# EAGLE design schematic.luminosidade.controle (EAGLE 6.5.0)
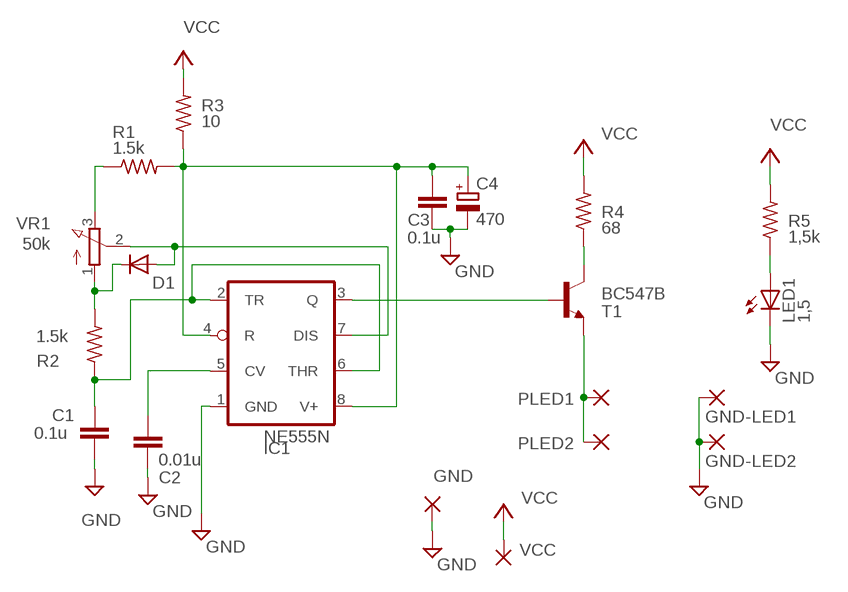
[diagram p0: schematic, sheet 1]

## Parts
C1  0.1u  C-EU025-024X044  [C025-024X044]
C2  0.01u  C-EU025-024X044  [C025-024X044]
C3  0.1u  C-EU025-024X044  [C025-024X044]
C4  470  CPOL-EUE3.5-10  [E3,5-10]
D1  1N4148DO35-7  [DO35-7]
GND  ET1  2,15/1,0  [2,15/1,0]
GND-LED1  GPAD  2,15/1,0  [2,15/1,0]
GND-LED2  GPAD  2,15/1,0  [2,15/1,0]
IC1  NE555N  [DIL08]
LED1  1,5  LED5MM  [LED5MM]
PLED1  ET1  2,15/1,0  [2,15/1,0]
PLED2  ET1  2,15/1,0  [2,15/1,0]
R1  1.5k  R-US_0204/5  [0204/5]
R2  1.5k  R-US_0204/5  [0204/5]
R3  10  R-US_0204/5  [0204/5]
R4  68  R-US_0204/5  [0204/5]
R5  1,5k  R-US_0204/5  [0204/5]
T1  BC547B  [TO92]
VCC  ET1  2,15/1,0  [2,15/1,0]
VR1  50k  3RP/1610N  [3RP/1610N]

## Nets
GND: C1.2 C2.2 C3.2 C4.- GND-LED1.1(P) GND-LED2.1(P) GND.1(P) IC1.1(GND) LED1.K(C)
N$1: C1.1 IC1.2(TR) IC1.6(THR) R2.1
N$2: D1.C R2.2 VR1.1(A)
N$3: D1.A IC1.7(DIS) VR1.2(S)
N$4: C2.1 IC1.5(CV)
N$5: R1.1 VR1.3(E)
N$6: IC1.3(Q) T1.2(B)
N$7: C3.1 C4.+ IC1.4(R) IC1.8(V+) R1.2 R3.1
N$8: R4.1 T1.3(C)
N$9: LED1.A R5.1
N$10: PLED1.1(P) PLED2.1(P) T1.1(E)
VCC: R3.2 R4.2 R5.2 VCC.1(P)

## Library data of the parts
C1-C3 = rcl:C-EU: CAPACITOR, European symbol
C4 = rcl:CPOL-EU: POLARIZED CAPACITOR, European symbol
D1 = diode:1N4148: DIODE high speed (Philips)
GND GND-LED1 GND-LED2 PLED1 PLED2 VCC = wirepad:2,15/1,0: THROUGH-HOLE PAD
IC1 = linear:*555: TIMER
LED1 = led:LED: LED OSRAM: - CHIPLED LG R971, LG N971, LY N971, LG Q971, LY Q971, LO R971, LY R971 LH N974, LH R974 LS Q976, LO Q976, LY Q976 LO Q996 - Hyper CHIPLED LW Q18S LB Q993, LB Q99A, LB R99A - SideLED LS A670, LO A670, LY A670, LG A670, LP A670 LB A673, LV A673, LT A673, LW A673 LH A674 LY A675 LS A676, LA A676, LO A676, LY A676, LW A676 LS A679, LY A679, LG A679 - Hyper Micro SIDELED® LS Y876, LA Y876, LO Y876, LY Y876 LT Y87S - SmartLED LW L88C, LW L88S LB L89C, LB L89S, LG L890 LS L89K, LO L89K, LY L89K LS L896, LA L896, LO L896, LY L896 - TOPLED LS T670, LO T670, LY T670, LG T670, LP T670 LSG T670, LSP T670, LSY T670, LOP T670, LYG T670 LG T671, LOG T671, LSG T671 LB T673, LV T673, LT T673, LW T673 LH T674 LS T676, LA T676, LO T676, LY T676, LB T676, LH T676, LSB T676, LW T676 LB T67C, LV T67C, LT T67C, LS T67K, LO T67K, LY T67K, LW E67C LS E67B, LA E67B, LO E67B, LY E67B, LB E67C, LV E67C, LT E67C LW T67C LS T679, LY T679, LG T679 LS T770, LO T770, LY T770, LG T770, LP T770 LB T773, LV T773, LT T773, LW T773 LH T774 LS E675, LA E675, LY E675, LS T675 LS T776, LA T776, LO T776, LY T776, LB T776 LHGB T686 LT T68C, LB T68C - Hyper Mini TOPLED® LB M676 - Mini TOPLED Santana® LG M470 LS M47K, LO M47K, LY M47K Source: http://www.osram.convergy.de LUXEON: - LUMILED® LXK2-PW12-R00, LXK2-PW12-S00, LXK2-PW14-U00, LXK2-PW14-V00 LXK2-PM12-R00, LXK2-PM12-S00, LXK2-PM14-U00 LXK2-PE12-Q00, LXK2-PE12-R00, LXK2-PE12-S00, LXK2-PE14-T00, LXK2-PE14-U00 LXK2-PB12-K00, LXK2-PB12-L00, LXK2-PB12-M00, LXK2-PB14-N00, LXK2-PB14-P00, LXK2-PB14-Q00 LXK2-PR12-L00, LXK2-PR12-M00, LXK2-PR14-Q00, LXK2-PR14-R00 LXK2-PD12-Q00, LXK2-PD12-R00, LXK2-PD12-S00 LXK2-PH12-R00, LXK2-PH12-S00 LXK2-PL12-P00, LXK2-PL12-Q00, LXK2-PL12-R00 Source: www.luxeon.com KINGBRIGHT: KA-3528ASYC Source: www.kingbright.com
R1-R5 = rcl:R-US_: RESISTOR, American symbol
T1 = transistor-npn:BC547*: NPN Transistor
VR1 = pot:3RP/1610N: 16mm Potentiometer one level Source: http://www.alphapotentiometers.net/html/16mm_pot_2.html

## Board
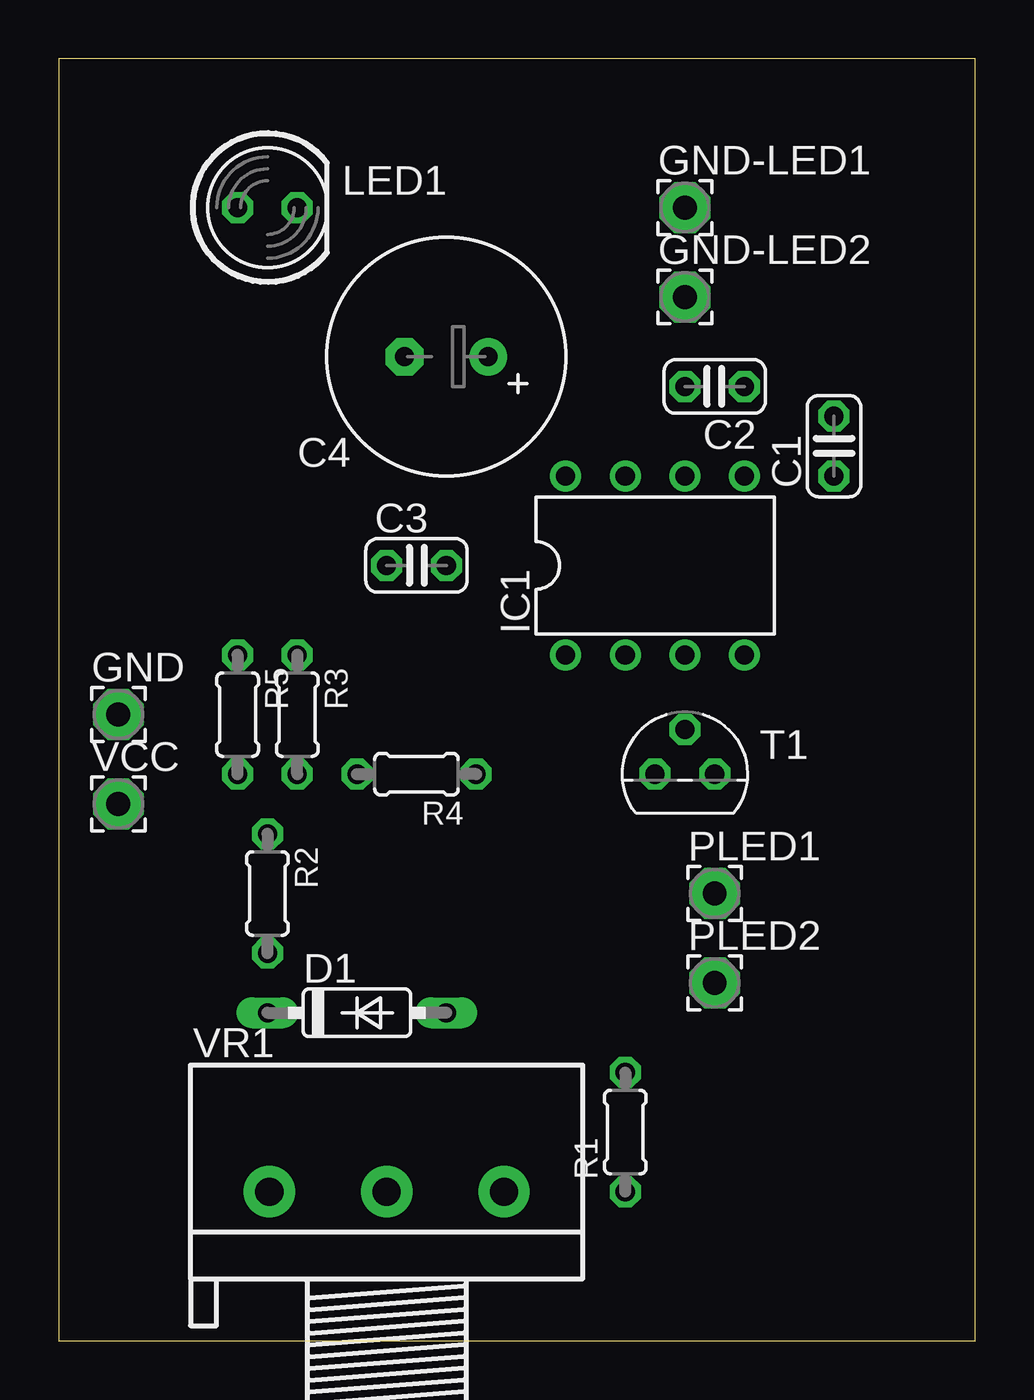
[diagram p1: board, top side]
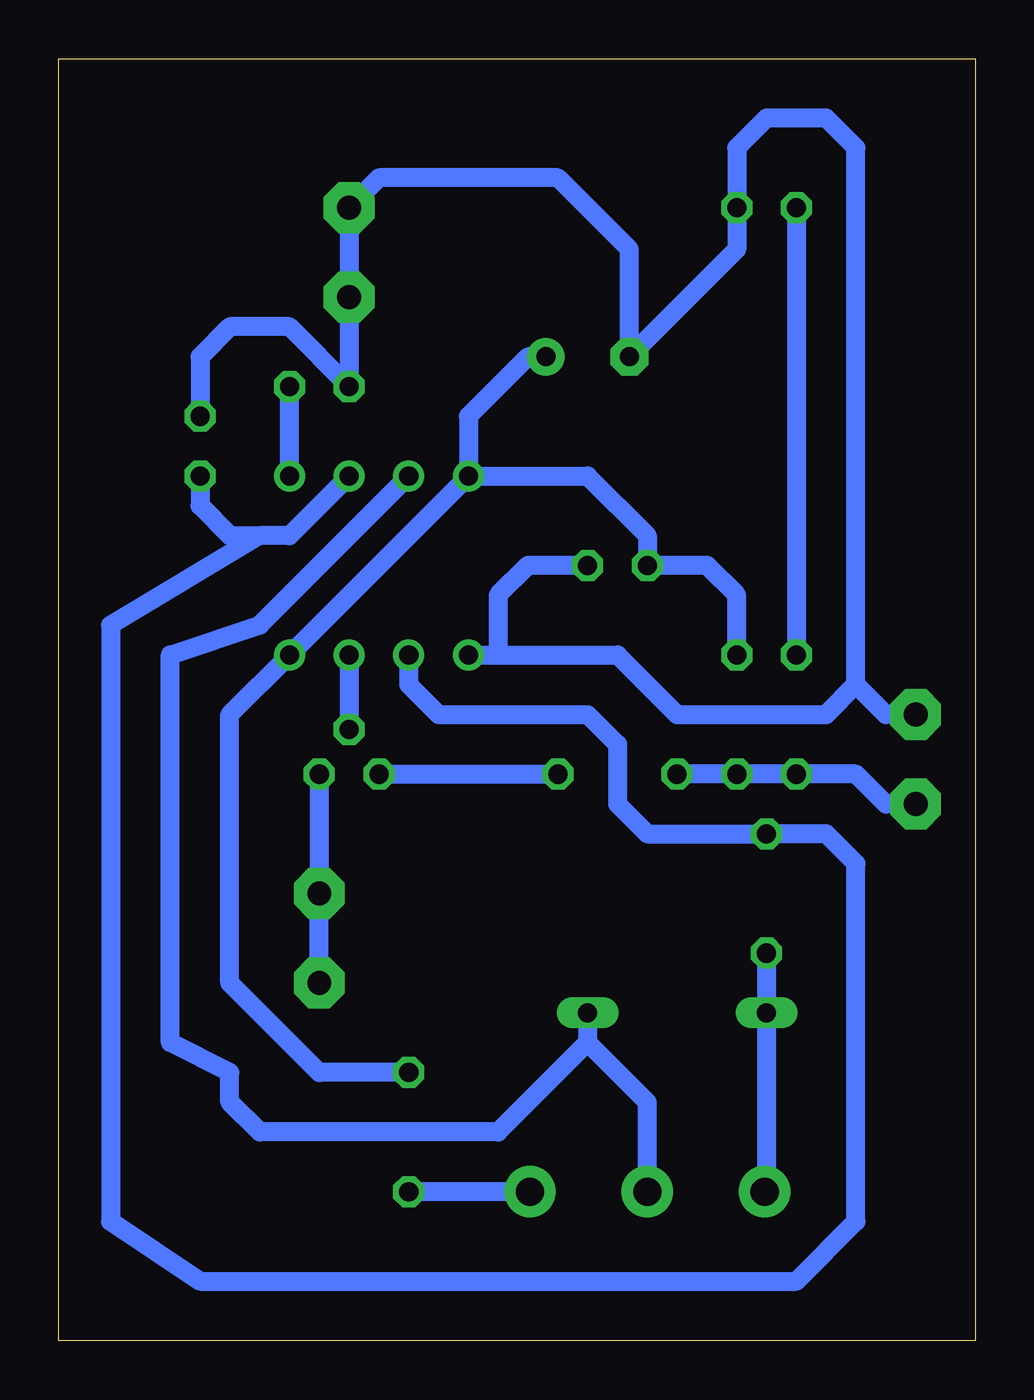
[diagram p2: board, bottom side, seen from below]

Size 39.04 x 54.6 mm. Coordinates in mm from the lower left corner, seen from the top.
Outline: 0,0 39.04,0 39.04,54.6 0,54.6 0,0
Copper layers (1*16): Top 0.035mm / dielectric 1.5mm / Bottom 0.035mm
Design rules "default": minimum track width 10mil, minimum drill 24mil, track to track 8mil, track to pad 8mil, pad to pad 8mil, via to via 8mil, smd to smd 8mil, copper to edge 40mil, drill to drill 8mil, minimum pad ring 10mil, minimum via ring 8mil, stop-mask expansion 4mil, vias tented up to drill 0mil, thermal gap 10mil

### Footprints (pad centres in the part's own frame; a part is rotated, then mirrored left to right if it is on the bottom)
C025-024X044 = drill 0.813 octagon: 1 -1.27,0; 2 1.27,0
E3,5-10 = drill 0.813 pad 1.6: + -1.778,0 | drill 0.813 pad 1.6 octagon: - 1.778,0
DO35-7 = drill 0.813 long: A 3.81,0; C -3.81,0
2,15/1,0 = drill 1.016 pad 2.159 octagon: 1 0,0
DIL08 = drill 0.813 pad 1.27: 1 -3.81,-3.81; 2 -1.27,-3.81; 3 1.27,-3.81; 4 3.81,-3.81; 5 3.81,3.81; 6 1.27,3.81; 7 -1.27,3.81; 8 -3.81,3.81
LED5MM = drill 0.813 octagon: A -1.27,0; K 1.27,0
0204/5 = drill 0.813 octagon: 1 -2.54,0; 2 2.54,0
TO92 = drill 0.813 octagon: 1 1.27,0; 2 0,1.905; 3 -1.27,0
3RP/1610N = drill 1.2 pad 2.184: 1 -5,0; 2 0,0; 3 5,0

### Placement (x,y rotation side)
C1  33.02,38.1 90 top
C2  27.94,40.64 180 top
C3  15.24,33.02 0 top
C4  16.51,41.91 180 top
D1  12.7,13.97 0 top
GND  2.54,26.67 0 top
GND-LED1  26.67,48.26 0 top
GND-LED2  26.67,44.45 0 top
IC1  25.4,33.02 0 top
LED1  8.89,48.26 0 top
PLED1  27.94,19.05 0 top
PLED2  27.94,15.24 0 top
R1  24.13,8.89 90 top
R2  8.89,19.05 270 top
R3  10.16,26.67 270 top
R4  15.24,24.13 180 top
R5  7.62,26.67 270 top
T1  26.67,24.13 0 top
VCC  2.54,22.86 0 top
VR1  13.97,6.35 0 top

### Tracks (layer width: path | path; a pad name or v marks a point on that pad's centre or on a via)
GND
  Bottom 0.813: C1.2 33.02,41.91 31.75,43.18 29.21,43.18 C2.2 GND-LED2.1 GND-LED1.1 25.4,49.53 17.78,49.53 14.73,46.48 C4.- 10.16,46.48 LED1.K 10.16,50.8 8.89,52.07 6.35,52.07 5.08,50.8 5.08,27.94 | IC1.1 20.32,29.21 | 5.08,27.94 6.35,26.67 12.7,26.67 15.24,29.21 20.32,29.21 | C3.2 19.05,33.02 20.32,31.75 20.32,29.21 | GND.1 3.81,26.67 5.08,27.94
N$1
  Bottom 0.813: C1.1 33.02,35.56 31.75,34.29 30.48,34.29 | IC1.6 29.21,34.29 30.48,34.29 | 30.48,34.29 36.83,30.48 36.83,5.08 33.02,2.54 7.62,2.54 5.08,5.08 5.08,20.32 6.35,21.59 R2.1 13.97,21.59 15.24,22.86 15.24,25.4 16.51,26.67 22.86,26.67 24.13,27.94 IC1.2
N$2
  Bottom 0.813: VR1.1 8.89,6.43 D1.C R2.2
N$3
  Bottom 0.813: VR1.2 13.97,10.16 16.51,12.7 | D1.A 16.51,12.7 | 16.51,12.7 20.32,8.89 30.48,8.89 31.75,10.16 31.75,11.43 34.29,12.7 34.29,29.21 30.48,30.48 IC1.7
N$4
  Bottom 0.813: IC1.5 C2.1
N$5
  Bottom 0.813: VR1.3 R1.1
N$6
  Bottom 0.813: IC1.3 T1.2
N$7
  Bottom 0.813: R1.2 27.94,11.43 31.75,15.24 31.75,26.67 IC1.4 IC1.8 | C4.+ 19.05,41.91 21.59,39.37 IC1.8 | R3.1 10.16,31.75 11.43,33.02 C3.1 13.97,34.29 16.51,36.83 IC1.8
N$8
  Bottom 0.813: T1.3 R4.1
N$9
  Bottom 0.813: LED1.A R5.1
N$10
  Bottom 0.813: PLED2.1 PLED1.1 T1.1
VCC
  Bottom 0.813: R4.2 R3.2 R5.2 5.08,24.13 3.81,22.86 VCC.1